# Altium schematic sheet Schematic1P1.schdoc
size 297 x 209 mm; Symbol: Drawing-Symbol_A4; @Project Name: SCH_sd-net-1.5_2025-11-29; @Page Count: 1; @Update Date: 2025-12-05; @Create Date: 2025-11-29; @Schematic Name: Schematic1; @Page No: 1; @Page Name: P1; Company: EasyEDA.com; Version: V1.0; Page Size: A4; @Create Time: 10:37:46; @Update Time: 12:06:12; Border: 1; Width: 1170; Height: 825; Region Start: 1; X Region Count: 6; Y Region Count: 4; Blade Width: 10; Color: #000000; Title Block Position: 3; @Board Name: sd - net 1.5; Device: Drawing-Symbol_A4
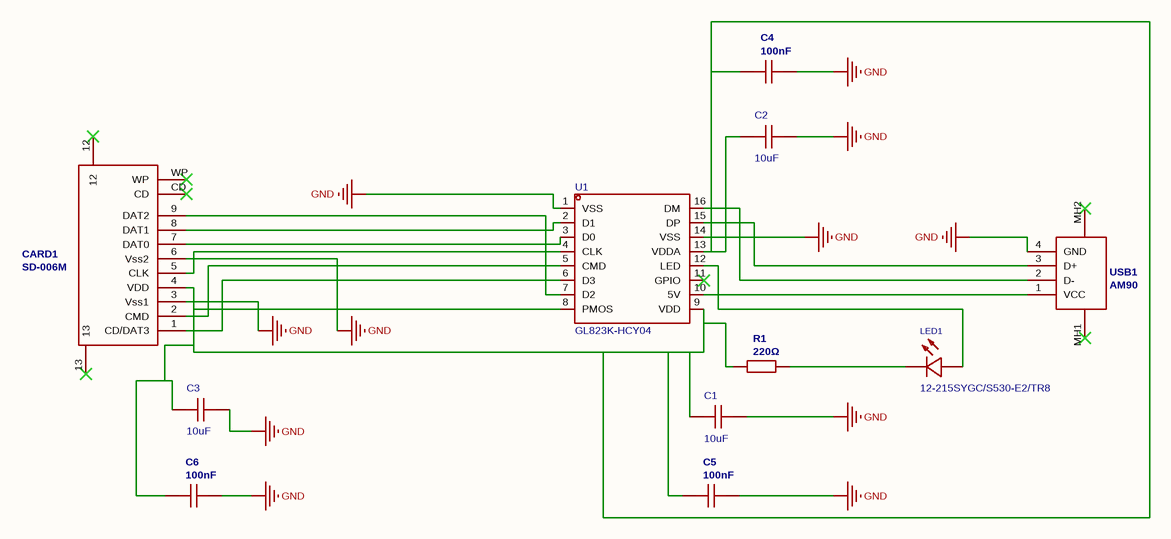
[diagram p0: Schematic1P1.schdoc]

## Parts
C1  10uF  [C0805]
C2  10uF  [C0805]
C3  10uF  [C0805]
C4  100nF  [C0603]
C5  100nF  [C0603]
C6  100nF  [C0603]
CARD1  SD-006M  [SD-SMD_SD-006M]
LED1  12-215SYGC/S530-E2/TR8  [LED-SMD_12-215SYGC-S530-E2-TR8]
R1  220Ω  [R0603]
U1  GL823K-HCY04  [SSOP-16_L4.9-W3.9-P0.64-LS6.0-BL]
USB1  AM90  [USB-AM-TH_AM90]

## Nets
GND: C1.2 C2.2 C3.2 C4.2 C5.2 C6.2 CARD1.3(Vss1) CARD1.6(Vss2) U1.1(VSS) U1.14(VSS) USB1.4(GND)
NetC1_1: C1.1 C2.1 C3.1 C4.1 C5.1 C6.1 CARD1.4(VDD) R1.1 U1.8(PMOS) U1.9(VDD) U1.13(VDDA)
NetCARD1_1: CARD1.1(CD/DAT3) U1.6(D3)
NetCARD1_2: CARD1.2(CMD) U1.5(CMD)
NetCARD1_5: CARD1.5(CLK) U1.4(CLK)
NetCARD1_7: CARD1.7(DAT0) U1.3(D0)
NetCARD1_8: CARD1.8(DAT1) U1.2(D1)
NetCARD1_9: CARD1.9(DAT2) U1.7(D2)
NetLED1_1: LED1.1(+) U1.12(LED)
NetLED1_2: LED1.2(-) R1.2
NetU1_10: U1.10(5V) USB1.1(VCC)
NetU1_15: U1.15(DP) USB1.3(D+)
NetU1_16: U1.16(DM) USB1.2(D-)

Not connected (* = marked no-connect by the designer): CARD1 12* 13* CD* WP*; U1 11(GPIO)*; USB1 MH1* MH2*

## Library data of the parts
C1-C3 = CL21A106KAYNNNE_C15850: Capacitance:10uF Tolerance:±10% Tolerance:±10% Voltage Rating:25V Temperature Coefficient:X5R; Manufacturer: SAMSUNG(三星); AddInBom: yes; ModelId: 8c88e81f49c6409b980720ec8953afb6; ModelName: C0805_L2.0-W1.3-H1.3; ModelTransform: 78.74,51.181,0,0,0,0,0,0.0005,0; Tolerance: ±10%; Voltage Rating: 25V; Temperature Coefficient: X5R; Symbol: CL21A106KAYNNNE; Device: CL21A106KAYNNNE_C15850; LCSC Part Name: 10uF ±10% 25V; SupplierPart: C15850; ManufacturerPart: CL21A106KAYNNNE; Supplier Footprint: 0805; JLCPCB Part Class: Basic Part; Datasheet: https://item.szlcsc.com/datasheet/CL21A106KAYNNNE/16532.html; Supplier: LCSC; ConvertToPcb: yes; FootprintName: C0805; Value: 10uF
C4 C6 = 100nF: Manufacturer: YAGEO(国巨); ManufacturerPart: CC0603KRX7R9BB104; nameAlias: Value; ConvertToPcb: yes; ModelId: aa7bfa10aa9749d3a2674a0b8f4166b3; Origin Footprint: C0603; Device: 100nF; Symbol: 100nF; spicePre: C; spiceSymbolName: CC0603KRX7R9BB104; Supplier: LCSC; SupplierPart: C14663; JLCPCB Part Class: Basic Part; AddInBom: yes; FootprintName: C0603; ModelName: C0603
C5 = 100nF: Manufacturer: YAGEO(国巨); Manufacturer Part: CC0603KRX7R9BB104; Add into BOM: yes; nameAlias: Value; ModelId: aa7bfa10aa9749d3a2674a0b8f4166b3; Convert to PCB: yes; Symbol: 100nF; Origin Footprint: C0603; Device: 100nF; Supplier: LCSC; Supplier Part: C14663; JLCPCB Part Class: Basic Part; spicePre: C; spiceSymbolName: CC0603KRX7R9BB104; FootprintName: C0603; ModelName: C0603
CARD1 = SD-006M: Manufacturer: SOFNG(硕方); Contributor: LCSC; ConvertToPcb: yes; ModelId: 522f805ef9944bc7a918dd8ea12da3cd; Origin Footprint: SD-SMD_SD-006M; Device: SD-006M; Symbol: SD-006M; spicePre: C; spiceSymbolName: SD-006M; Supplier: LCSC; ManufacturerPart: SD-006M; SupplierPart: C125615; JLCPCB Part Class: Extended Part; AddInBom: yes; FootprintName: SD-SMD_SD-006M; ModelName: SD-SMD_SD-006M
LED1 = 12-215SYGC/S530-E2/TR8: Illumination Color:Yellow Green Voltage - Forward(Vf):2V Voltage - Forward(Vf):2V Forward Current:20mA Wavelength - Dominant:573nm Wavelength - Dominant:573nm Peak Wavelength:575nm Lens Color:Water Clear Luminous Intensity:20.5mcd Luminous Intensity:20.5m; Manufacturer: EVERLIGHT(亿光); AddInBom: yes; ModelId: ee9b7918b4ff4ab5a0da8d240f8f09cd; ModelName: LED-SMD_2P-L2.1-W1.0-H0.6; ModelTransform: 83.4644,39.37,0,0,0,0,-0.001,8.819,0; Voltage - Forward(Vf): 2V; Forward Current: 20mA; Wavelength - Dominant: 573nm; Peak Wavelength: 575nm; Viewing Angle: 130°; Symbol: 12-215SYGC/S530-E2/TR8; Device: 12-215SYGC/S530-E2/TR8; Supplier: LCSC; Supplier Part: C131283; Manufacturer Part: 12-215SYGC/S530-E2/TR8; JLCPCB Part Class: Extended Part; LCSC Part Name: 普绿/黄绿; Supplier Footprint: SMD,2.1x1mm; ConvertToPcb: yes; FootprintName: LED-SMD_12-215SYGC-S530-E2-TR8; Illumination Color: Yellow Green; Lens Color: Water Clear; Luminous Intensity: 20.5mcd
R1 = 220Ω: Manufacturer: UNI-ROYAL(厚声); ManufacturerPart: 0603WAF2200T5E; nameAlias: Value; ConvertToPcb: yes; ModelId: 112863783b5b41f1b5254f87eedc7932; Origin Footprint: R0603; Device: 220Ω; Symbol: 220Ω; spicePre: R; spiceSymbolName: 0603WAF2200T5E; Supplier: LCSC; SupplierPart: C22962; JLCPCB Part Class: Basic Part; AddInBom: yes; FootprintName: R0603; ModelName: R0603
U1 = GL823K-HCY04: Applications Function:- Protocol:-; Manufacturer: GENESYS(创惟); AddInBom: yes; ModelId: fa78b41de907473cb607d7a2d2e2aa84; ModelName: SSOP-16_L4.9-W3.9-H1.75-LS6.0_P0.64; ModelTransform: 240.39054,192.913,0,90,0,0,-0.0005,0.0005,0; Symbol: GL823K-HCY04; Device: GL823K-HCY04; LCSC Part Name: USB 2.0 SD/MSPRO 卡读取控制器; SupplierPart: C284879; ManufacturerPart: GL823K-HCY04; Supplier Footprint: SSOP-16-150mil; JLCPCB Part Class: Extended Part; Datasheet: https://item.szlcsc.com/datasheet/GL823K-HCY04/270382.html; Supplier: LCSC; ConvertToPcb: yes; FootprintName: SSOP-16_L4.9-W3.9-P0.64-LS6.0-BL; Applications Function: -; Protocol: -
USB1 = AM90: Manufacturer: SHOU HAN(首韩); Contributor: LCSC; ConvertToPcb: yes; ModelId: 5569722cd8ed4b1c859a51483a504fba; Origin Footprint: USB-AM-TH_AM90; Device: AM90; Symbol: AM90; spicePre: U; spiceSymbolName: AM90; Supplier: LCSC; SupplierPart: C404965; ManufacturerPart: AM90; JLCPCB Part Class: Extended Part; AddInBom: yes; FootprintName: USB-AM-TH_AM90; ModelName: USB-AM-TH_AM90